# Altium schematic sheet SIM7600CE.SchDoc
size A3; SheetNumber: 4; SheetTotal: 5
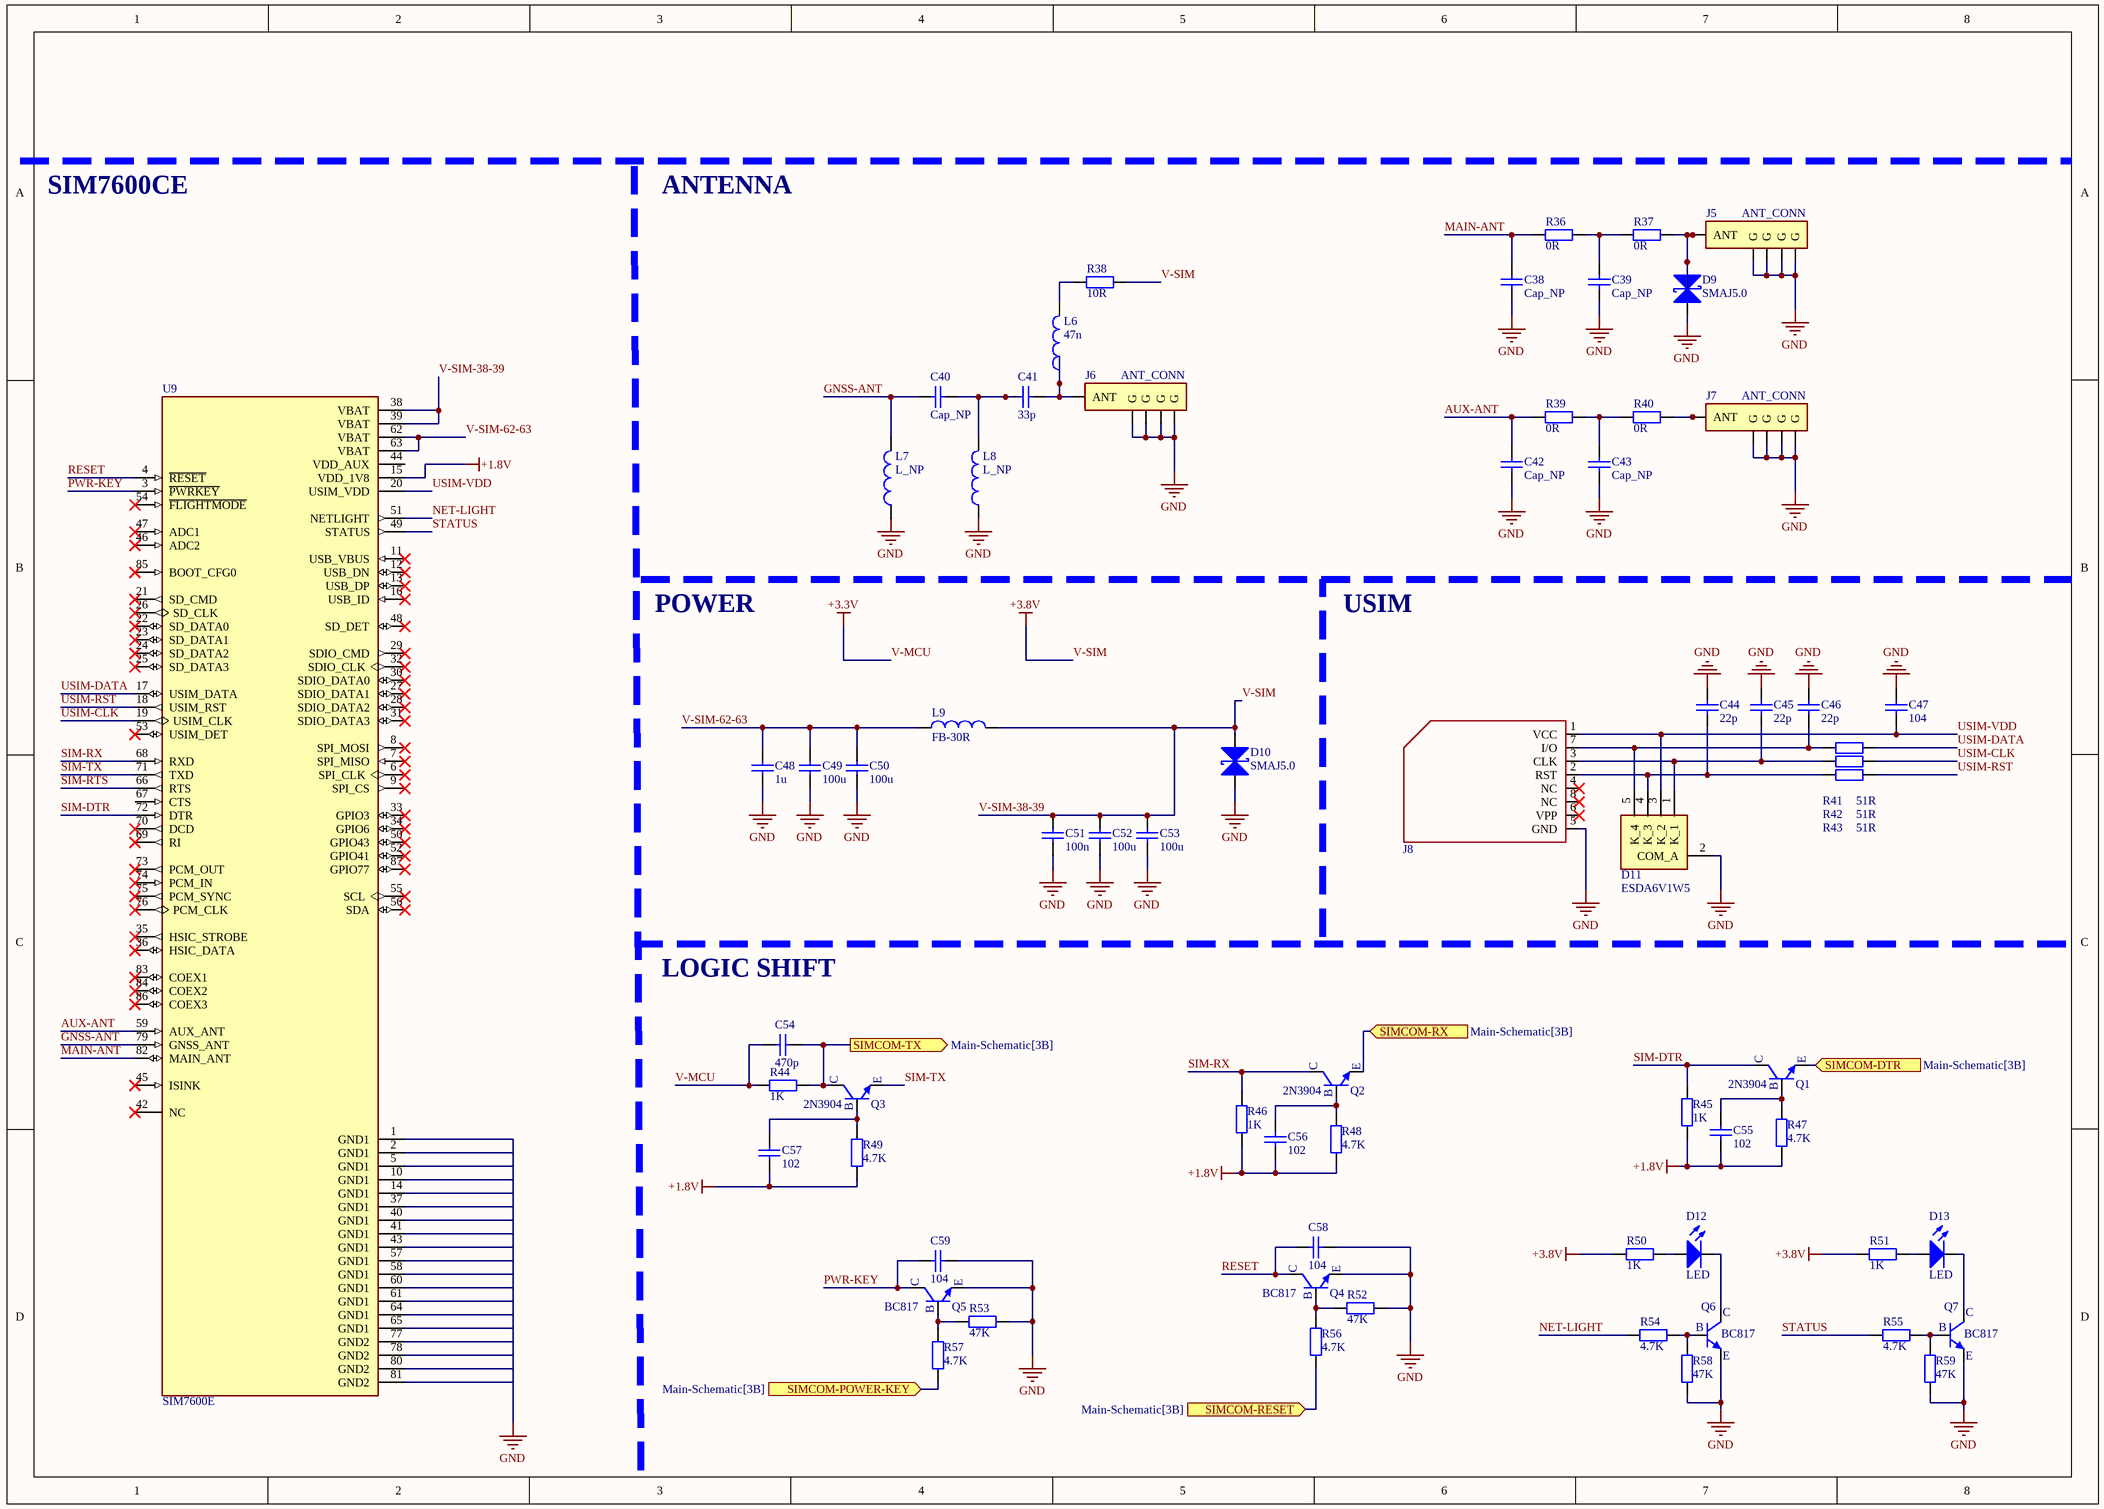
[diagram p0: SIM7600CE.SchDoc]

## Parts
C38  Cap_NP  [CAP_0603]
C39  Cap_NP  [CAP_0603]
C40  Cap_NP  [CAP_0603]
C41  33p  [CAP_0603]
C42  Cap_NP  [CAP_0603]
C43  Cap_NP  [CAP_0603]
C44  22p  [CAP_0603]
C45  22p  [CAP_0603]
C46  22p  [CAP_0603]
C47  104  [CAP_0603]
C48  1u  [CAP_0603]
C49  100u  [C_Tanta_B3528]
C50  100u  [C_Tanta_B3528]
C51  100n  [CAP_0603]
C52  100u  [C_Tanta_B3528]
C53  100u  [C_Tanta_B3528]
C54  470p  [CAP_0603]
C55  102  [CAP_0603]
C56  102  [CAP_0603]
C57  102  [CAP_0603]
C58  104  [CAP_0603]
C59  104  [CAP_0603]
D9  SMAJ5.0  [SMA]
D10  SMAJ5.0  [SMA]
D11  ESDA6V1W5  [SOT65P210X110-5N]
D12  LED  [LED-0805-Red]
D13  LED  [LED-0805-Red]
J5  ANT_CONN  [IPEX]
J6  ANT_CONN  [IPEX]
J7  ANT_CONN  [IPEX]
J8  MicroSimcard  [MICRO SIM SOCKET]  (value not drawn)
L6  47n  [INDC-0805]
L7  L_NP  [INDC-0805]
L8  L_NP  [INDC-0805]
L9  FB-30R  [INDC-0805]
Q1  2N3904  [SOT-23]
Q2  2N3904  [SOT-23]
Q3  2N3904  [SOT-23]
Q4  BC817  [SOT-23]
Q5  BC817  [SOT-23]
Q6  BC817  [SOT-23]
Q7  BC817  [SOT-23]
R36  0R  [RES_0603]
R37  0R  [RES_0603]
R38  10R  [RES_0603]
R39  0R  [RES_0603]
R40  0R  [RES_0603]
R41  51R  [RES_0603]
R42  51R  [RES_0603]
R43  51R  [RES_0603]
R44  1K  [RES_0603]
R45  1K  [RES_0603]
R46  1K  [RES_0603]
R47  4.7K  [RES_0603]
R48  4.7K  [RES_0603]
R49  4.7K  [RES_0603]
R50  1K  [RES_0603]
R51  1K  [RES_0603]
R52  47K  [RES_0603]
R53  47K  [RES_0603]
R54  4.7K  [RES_0603]
R55  4.7K  [RES_0603]
R56  4.7K  [RES_0603]
R57  4.7K  [RES_0603]
R58  47K  [RES_0603]
R59  47K  [RES_0603]
U9  SIM7600E  [XCVR_SIM7600E]

## Ports
SIMCOM-DTR (in, see Main-Schematic[3B]), SIMCOM-POWER-KEY (in, see Main-Schematic[3B]), SIMCOM-RESET (in, see Main-Schematic[3B]), SIMCOM-RX (in, see Main-Schematic[3B]), SIMCOM-TX (out, see Main-Schematic[3B])

## Nets
+1.8V: C55.1 C56.1 C57.1 R45.1 R46.1 R47.1 R48.1 R49.1 U9.15(VDD_1V8)
GND: C38.1 C39.1 C42.1 C43.1 C44.2 C45.2 C46.2 C47.2 C48.1 C49.1 C50.1 C51.1 C52.1 C53.1 C58.2 C59.2 D9.1(K) D10.1(K) D11.2(COM_A) J5.2(G) J5.3(G) J5.4(G) J5.5(G) J6.2(G) J6.3(G) J6.4(G) J6.5(G) J7.2(G) J7.3(G) J7.4(G) J7.5(G) J8.5(GND) L7.1 L8.1 Q4.3(E) Q5.3(E) Q6.3(E) Q7.3(E) R52.2 R53.2 R58.1 R59.1
V-MCU: C54.2 R44.2  [also labelled +3.3V]
V-SIM: C51.2 C52.2 C53.2 D10.2(A) L9.2 R38.1 R50.2 R51.2 U9.38(VBAT) U9.39(VBAT)  [also labelled +3.8V, V-SIM-38-39]
AUX-ANT: C42.2 R39.1 U9.59(AUX_ANT)
GNSS-ANT: C40.2 L7.2 U9.79(GNSS_ANT)
MAIN-ANT: C38.2 R36.1 U9.82(MAIN_ANT)
NET-LIGHT: R54.2 U9.51(NETLIGHT)
PWR-KEY: C59.1 Q5.2(C) U9.3(~{PWRKEY})
RESET: C58.1 Q4.2(C) U9.4(~{RESET})
SIM-DTR: Q1.2(C) R45.2 U9.72(DTR)
SIM-RTS: U9.66(RTS)
SIM-RX: Q2.2(C) R46.2 U9.68(RXD)
SIM-TX: Q3.3(E) U9.71(TXD)
SIMCOM-DTR: Q1.3(E) ; port SIMCOM-DTR
SIMCOM-POWER-KEY: R57.1 ; port SIMCOM-POWER-KEY
SIMCOM-RESET: R56.1 ; port SIMCOM-RESET
SIMCOM-RX: Q2.3(E) ; port SIMCOM-RX
SIMCOM-TX: C54.1 Q3.2(C) R44.1 ; port SIMCOM-TX
STATUS: R55.2 U9.49(STATUS)
USIM-CLK: R42.2 U9.19(USIM_CLK)
USIM-DATA: R41.2 U9.17(USIM_DATA)
USIM-RST: R43.2 U9.18(USIM_RST)
USIM-VDD: C47.1 D11.3(K_2) J8.1(VCC) U9.20(USIM_VDD)
V-SIM-62-63: C48.2 C49.2 C50.2 L9.1 U9.62(VBAT) U9.63(VBAT)
NetC39_2: C39.2 R36.2 R37.1
NetC40_1: C40.1 C41.2 L8.2
NetC41_1: C41.1 J6.1(ANT) L6.1
NetC43_2: C43.2 R39.2 R40.1
NetC44_1: C44.1 D11.4(K_3) J8.2(RST) R43.1
NetC45_1: C45.1 D11.1(K_1) J8.3(CLK) R42.1
NetC46_1: C46.1 D11.5(K_4) J8.7(I/O) R41.1
NetC55_2: C55.2 Q1.1(B) R47.2
NetC56_2: C56.2 Q2.1(B) R48.2
NetC57_2: C57.2 Q3.1(B) R49.2
NetD9_2: D9.2(A) J5.1(ANT) R37.2
NetD12_1: D12.1(A) R50.1
NetD12_2: D12.2(K) Q6.2(C)
NetD13_1: D13.1(A) R51.1
NetD13_2: D13.2(K) Q7.2(C)
NetJ7_1: J7.1(ANT) R40.2
NetL6_2: L6.2 R38.2
NetQ4_1: Q4.1(B) R52.1 R56.2
NetQ5_1: Q5.1(B) R53.1 R57.2
NetQ6_1: Q6.1(B) R54.1 R58.2
NetQ7_1: Q7.1(B) R55.1 R59.2

Not connected (* = marked no-connect by the designer): J8 4(NC)* 6(VPP)* 8(NC)*; U9 1(GND1) 2(GND1) 5(GND1) 6(SPI_CLK)* 7(SPI_MISO)* 8(SPI_MOSI)* 9(SPI_CS)* 10(GND1) 11(USB_VBUS)* 12(USB_DN)* 13(USB_DP)* 14(GND1) 16(USB_ID)* 21(SD_CMD)* 22(SD_DATA0)* 23(SD_DATA1)* 24(SD_DATA2)* 25(SD_DATA3)* 26(SD_CLK)* 27(SDIO_DATA1)* 28(SDIO_DATA2)* 29(SDIO_CMD)* 30(SDIO_DATA0)* 31(SDIO_DATA3)* 32(SDIO_CLK)* 33(GPIO3)* 34(GPIO6)* 35(HSIC_STROBE)* 36(HSIC_DATA)* 37(GND1) 40(GND1) 41(GND1) 42(NC)* 43(GND1) 44(VDD_AUX) 45(ISINK)* 46(ADC2)* 47(ADC1)* 48(SD_DET)* 50(GPIO43)* 52(GPIO41)* 53(USIM_DET)* 54(~{FLIGHTMODE})* 55(SCL)* 56(SDA)* 57(GND1) 58(GND1) 60(GND1) 61(GND1) 64(GND1) 65(GND1) 67(CTS) 69(RI)* 70(DCD)* 73(PCM_OUT)* 74(PCM_IN)* 75(PCM_SYNC)* 76(PCM_CLK)* 77(GND2) 78(GND2) 80(GND2) 81(GND2) 83(COEX1)* 84(COEX2)* 85(BOOT_CFG0)* 86(COEX3)* 87(GPIO77)*

## Notes on the sheet
- SIM7600CE
- ANTENNA
- POWER
- USIM
- LOGIC SHIFT
- Labels drawn without touching a wire or pin: GND

## Library data of the parts
C38-C59 = Cap_NP: Non-polarized capacitor
D9 D10 = TVS-Diode: TVS diode
D11 = ESDA6V1W5: Integrated Circuit; Manufacturer_Name: STMicroelectronics; Datasheet Link: http://www.st.com/st-web-ui/static/active/en/resource/technical/document/datasheet/CD00064033.pdf; Height: 1.1mm; Manufacturer_Part_Number: ESDA6V1W5; Mouser Part Number: 511-ESDA6V1W5; Mouser Price/Stock: https://www.mouser.co.uk/ProductDetail/STMicroelectronics/ESDA6V1W5?qs=9NrABl3fj%2FrhT5vdkOmqXg%3D%3D; Arrow Part Number: ESDA6V1W5; Arrow Price/Stock: https://www.arrow.com/en/products/esda6v1w5/stmicroelectronics?utm_currency=USD&region=nac
D12 D13 = LED: Light Emitting Diode
J5-J7 = ANT_CONN: ATENNA PIN 1
J8 = MicroSimcard: Micro Simcard Socket
L6-L9 = Inductor: Code_IEC: 1005; Published: 8-Jun-2000; LatestRevisionDate: 29-May-2009; LatestRevisionNote: IPC-7351 Footprint Added.; PackageReference: 0402-A; Publisher: Altium Limited; PackageDescription: Chip Inductor; Code_JEITA: 0402
Q1-Q7 = N-Trans
R36-R59 = Resistor
U9 = SIM7600E: LTE-FDD/LTE-TDD/HSPA+/UMTS/EDGE/GPRS/GSM Module On Module 10Mbps 800MHz/850MHz/900MHz/1800MHz/2100MHz/2300MHz/2500MHz/2600MHz 3.4V to 4.2V 24dBm; MF: SIMCom Wireless Solutions Limited; SnapEDA_Link: https://www.snapeda.com/parts/SIM7600E/SIMCom/view-part/?ref=snap; Package: SMD-87 SIMCom; Value: *; MP: SIM7600E; Check_prices: https://www.snapeda.com/parts/SIM7600E/SIMCom/view-part/?ref=eda